# Altium schematic sheet kondratchenko_telemetry_board.SchDoc: =title_line_1 + title_line_2
size 840 x 594 mm; SheetNumber: n
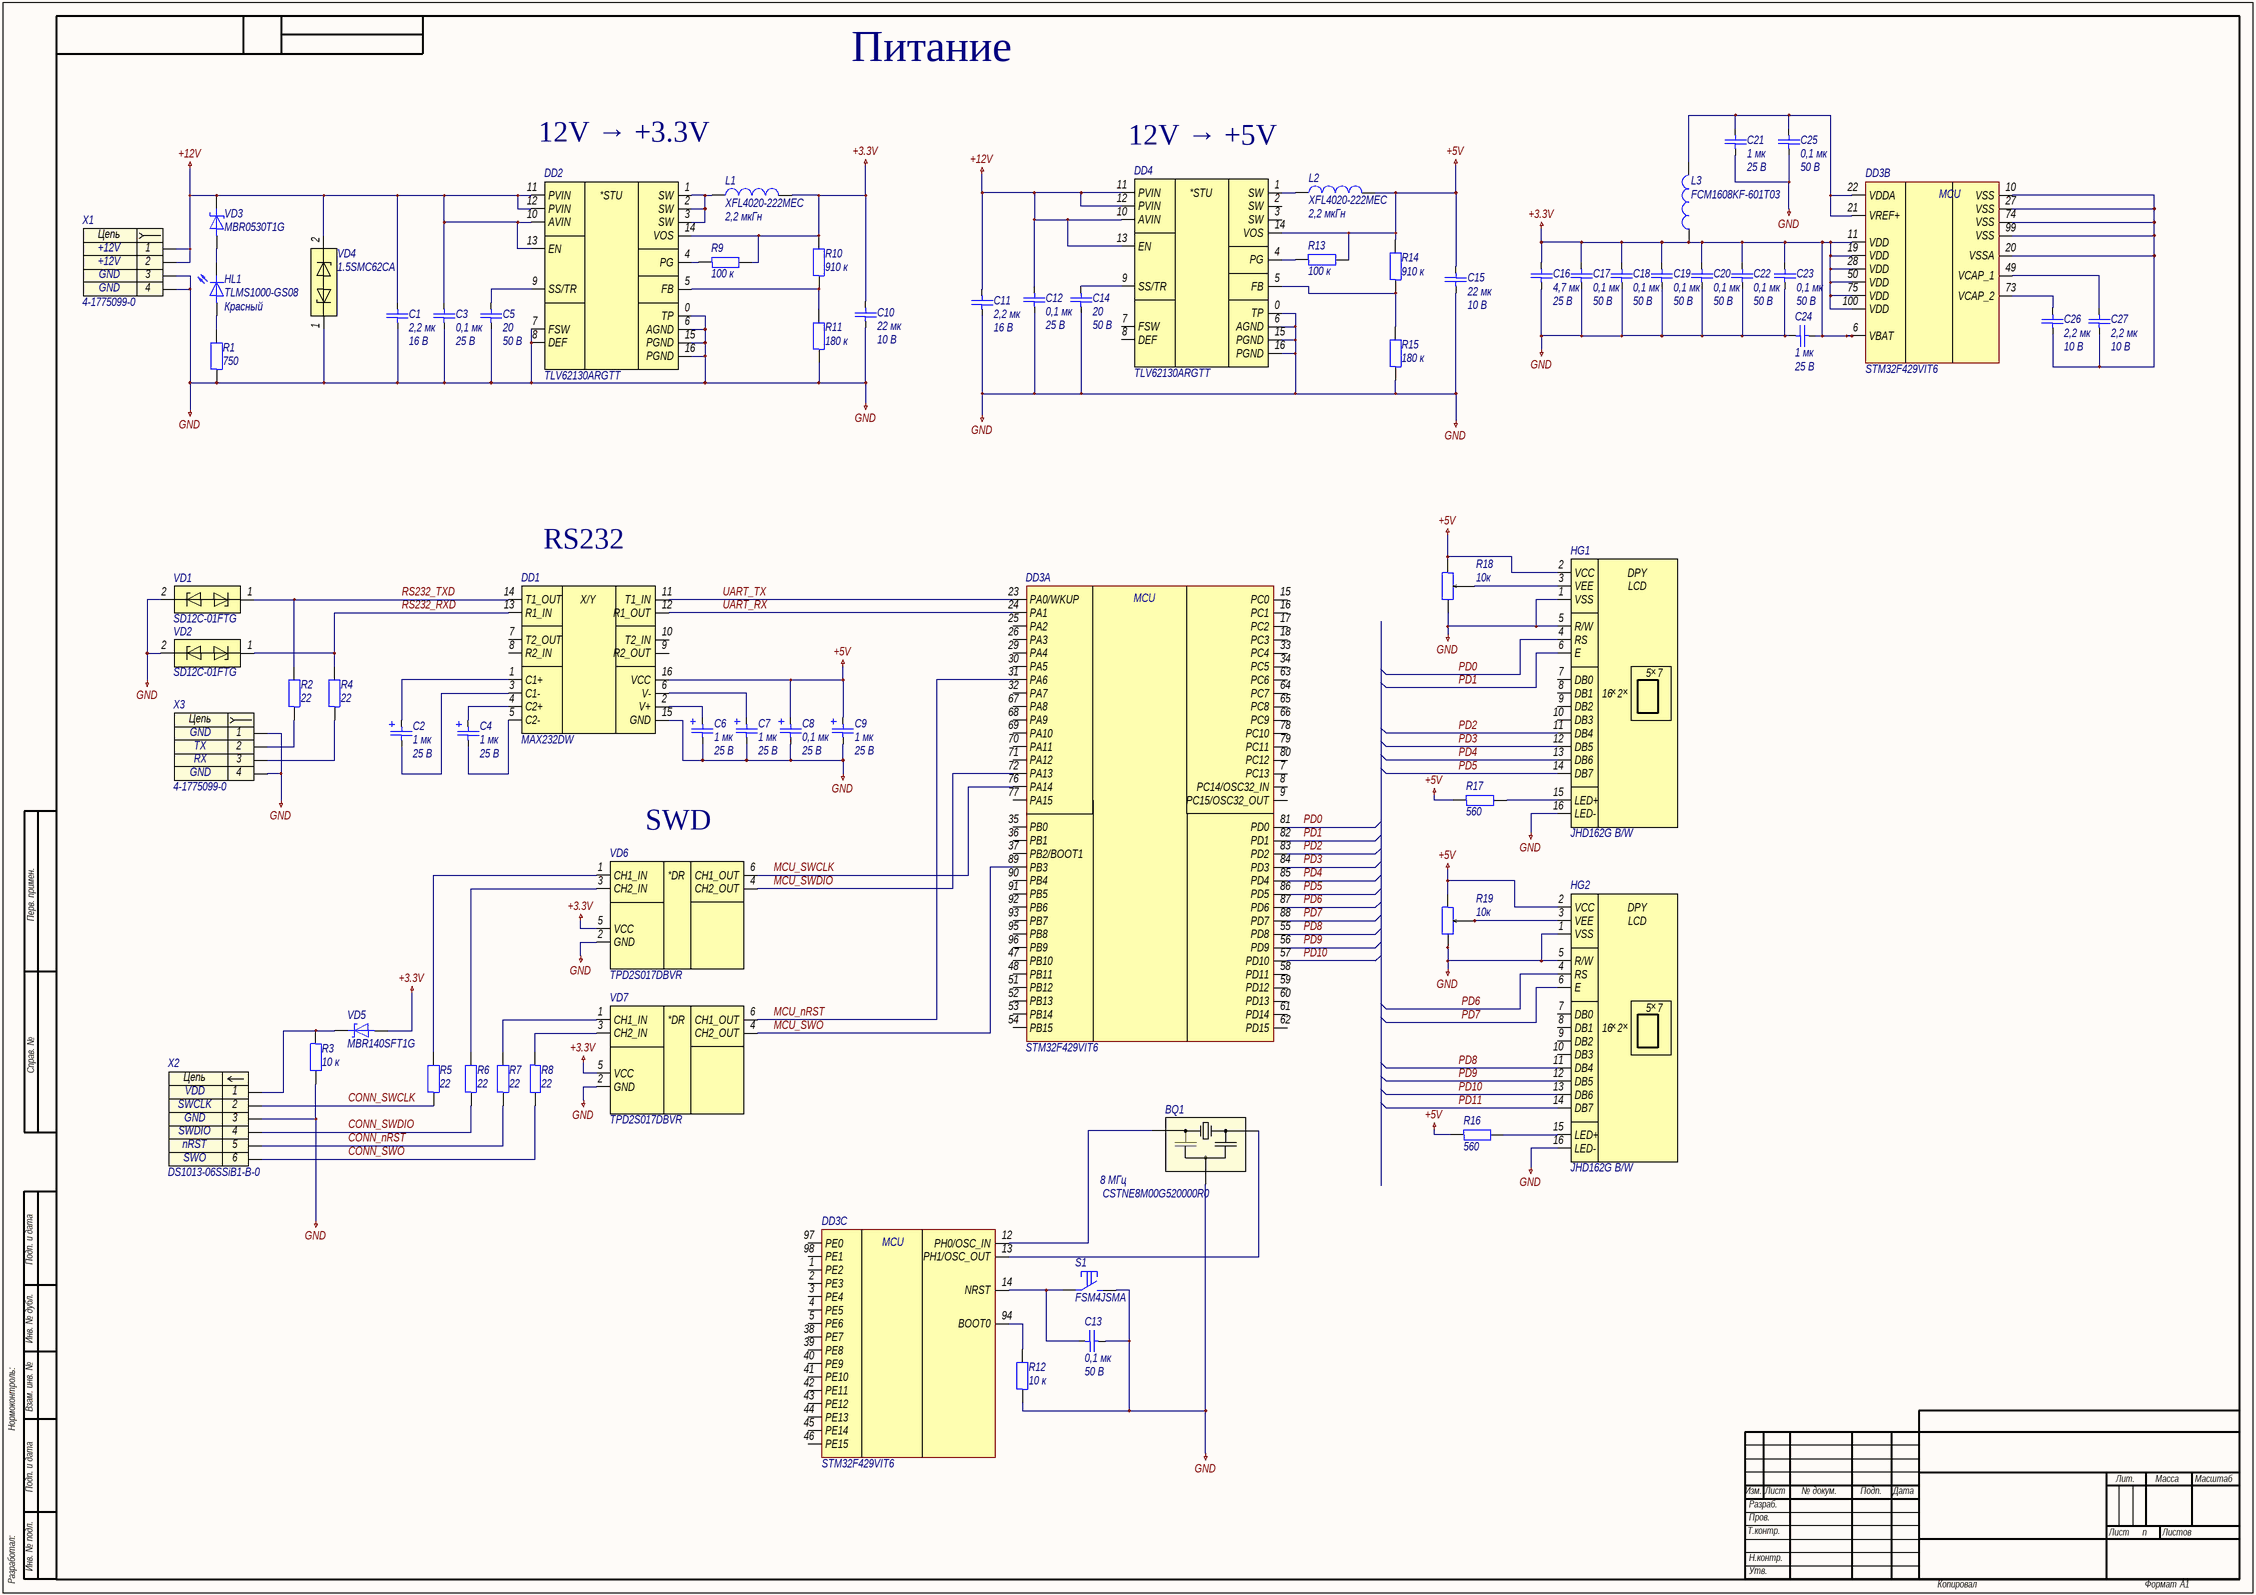
[diagram p0: kondratchenko_telemetry_board.SchDoc]

## Parts
BQ1  CSTNE8M00G520000R0  Частотa: 8 МГц  [CSTCE-3-P120-320X130X70]
C1  2,2 мк  Напряжение: 16 В  [C0603]
C2  1 мк  Напряжение: 25 В  [C3216-18]
C3  0,1 мк  Напряжение: 25 В  [C0603]
C4  1 мк  Напряжение: 25 В  [C3216-18]
C5  20  Напряжение: 50 В  [C0603]
C6  1 мк  Напряжение: 25 В  [C3216-18]
C7  1 мк  Напряжение: 25 В  [C3216-18]
C8  0,1 мк  Напряжение: 25 В  [C3216-18]
C9  1 мк  Напряжение: 25 В  [C3216-18]
C10  22 мк  Напряжение: 10 В  [C1206]
C11  2,2 мк  Напряжение: 16 В  [C0603]
C12  0,1 мк  Напряжение: 25 В  [C0603]
C13  0,1 мк  Напряжение: 50 В  [C0603]
C14  20  Напряжение: 50 В  [C0603]
C15  22 мк  Напряжение: 10 В  [C1206]
C16  4,7 мк  Напряжение: 25 В  [C0603]
C17  0,1 мк  Напряжение: 50 В  [C0603]
C18  0,1 мк  Напряжение: 50 В  [C0603]
C19  0,1 мк  Напряжение: 50 В  [C0603]
C20  0,1 мк  Напряжение: 50 В  [C0603]
C21  1 мк  Напряжение: 25 В  [C0603]
C22  0,1 мк  Напряжение: 50 В  [C0603]
C23  0,1 мк  Напряжение: 50 В  [C0603]
C24  1 мк  Напряжение: 25 В  [C0603]
C25  0,1 мк  Напряжение: 50 В  [C0603]
C26  2,2 мк  Напряжение: 10 В  [C0603]
C27  2,2 мк  Напряжение: 10 В  [C0603]
DD1  MAX232DW  [SOIC-16-P127-1030X750X265-L84X41]
DD2  TLV62130ARGTT  [WQFN-16-P50-300X300X100-L40X24-T168X168]
DD3  STM32F429VIT6  [LQFP-100-P50-1400X1400X160-L60X22]  (parts A,B,C of 3)
DD4  TLV62130ARGTT  [WQFN-16-P50-300X300X100-L40X24-T168X168]
HG1  JHD162G B/W  [JHD162G B/W]
HG2  JHD162G B/W  [JHD162G B/W]
HL1  TLMS1000-GS08  Цвет: Красный  [HL0603]
L1  XFL4020-222MEC  Индуктивность: 2,2 мкГн  [XFL-2-400X400X210]
L2  XFL4020-222MEC  Индуктивность: 2,2 мкГн  [XFL-2-400X400X210]
L3  FCM1608KF-601T03  [FCM-2-0603]
R1  750  [R0603]
R2  22  [R0603]
R3  10 к  [R0603]
R4  22  [R0603]
R5  22  [R0603]
R6  22  [R0603]
R7  22  [R0603]
R8  22  [R0603]
R9  100 к  [R0603]
R10  910 к  [R0603]
R11  180 к  [R0603]
R12  10 к  [R0603]
R13  100 к  [R0603]
R14  910 к  [R0603]
R15  180 к  [R0603]
R16  560  [R0603]
R17  560  [R0603]
R18  10к  [R3362]
R19  10к  [R3362]
S1  FSM4JSMA  [FSM4JSMA]
VD1  SD12C-01FTG  [SOD-323-257X130X114]
VD2  SD12C-01FTG  [SOD-323-257X130X114]
VD3  MBR0530T1G  [SOD-123-368X160X135]
VD4  1.5SMC62CA  [DO-214AB-790X590X262]
VD5  MBR140SFT1G  [SOD-123FL-370X165X98]
VD6  TPD2S017DBVR  [SOT-23-6-P95-290X280X145]
VD7  TPD2S017DBVR  [SOT-23-6-P95-290X280X145]
X1  4-1775099-0  [4-1775099-0]
X2  DS1013-06SSiB1-B-0  [DS1013-06SSiB1-B-0]
X3  4-1775099-0  [4-1775099-0]

## Nets
+3.3V: C10.1 C16.1 C17.1 C18.1 C19.1 C20.1 C22.1 C23.1 C24.1 DD2.14(VOS) DD3.6(VBAT) DD3.11(VDD) DD3.19(VDD) DD3.28(VDD) DD3.50(VDD) DD3.75(VDD) DD3.100(VDD) L1.2 L3.1 R9.2 R10.2 VD5.2 VD6.5(VCC) VD7.5(VCC)
+5V: C8.1 C9.1 C15.2 DD1.16(VCC) DD4.14(VOS) HG1.2(VCC) HG2.2(VCC) L2.2 R13.2 R14.2 R16.1 R17.1 R18.1 R19.1
+12V: C1.1 C3.1 C11.1 C12.1 DD2.10(AVIN) DD2.11(PVIN) DD2.12(PVIN) DD2.13(EN) DD4.10(AVIN) DD4.11(PVIN) DD4.12(PVIN) DD4.13(EN) VD3.1 VD4.2 X1.1 X1.2
GND: BQ1.2 C1.2 C3.2 C5.2 C6.2 C7.2 C8.2 C9.2 C10.2 C11.2 C12.2 C13.1 C14.2 C15.1 C16.2 C17.2 C18.2 C19.2 C20.2 C21.2 C22.2 C23.2 C24.2 C25.2 DD1.15(GND) DD2.0(TP) DD2.6(AGND) DD2.7(FSW) DD2.8(DEF) DD2.15(PGND) DD2.16(PGND) DD4.0(TP) DD4.6(AGND) DD4.15(PGND) DD4.16(PGND) HG1.1(VSS) HG1.5(R/W) HG1.16(LED-) HG2.1(VSS) HG2.5(R/W) HG2.16(LED-) R1.1 R3.2 R11.1 R12.1 R15.1 R18.3 R19.3 S1.2 VD1.2 VD2.2 VD4.1 VD6.2(GND) VD7.2(GND) X1.3 X1.4 X2.3 X3.1 X3.4
CONN_nRST: R7.1 X2.5
CONN_SWCLK: R5.1 X2.2
CONN_SWDIO: R6.1 X2.4
CONN_SWO: R8.2 X2.6
MCU_nRST: DD3.31(PA6) VD7.6(CH1_OUT)
MCU_SWCLK: DD3.76(PA14) VD6.6(CH1_OUT)
MCU_SWDIO: DD3.72(PA13) VD6.4(CH2_OUT)
MCU_SWO: DD3.89(PB3) VD7.4(CH2_OUT)
PD0: DD3.81(PD0) HG1.4(RS)
PD1: DD3.82(PD1) HG1.6(E)
PD2: DD3.83(PD2) HG1.11(DB4)
PD3: DD3.84(PD3) HG1.12(DB5)
PD4: DD3.85(PD4) HG1.13(DB6)
PD5: DD3.86(PD5) HG1.14(DB7)
PD6: DD3.87(PD6) HG2.4(RS)
PD7: DD3.88(PD7) HG2.6(E)
PD8: DD3.55(PD8) HG2.11(DB4)
PD9: DD3.56(PD9) HG2.12(DB5)
PD10: DD3.57(PD10) HG2.13(DB6)
PD11: HG2.14(DB7)
RS232_RXD: DD1.13(R1_IN) R4.2 VD2.1
RS232_TXD: DD1.14(T1_OUT) R2.2 VD1.1
UART_RX: DD1.12(R1_OUT) DD3.24(PA1)
UART_TX: DD1.11(T1_IN) DD3.23(PA0/WKUP)
NetBQ1_1: BQ1.1 DD3.13(PH1/OSC_OUT)
NetBQ1_3: BQ1.3 DD3.12(PH0/OSC_IN)
NetC2_1: C2.1 DD1.1(C1+)
NetC2_2: C2.2 DD1.3(C1-)
NetC4_1: C4.1 DD1.4(C2+)
NetC4_2: C4.2 DD1.5(C2-)
NetC5_1: C5.1 DD2.9(SS/TR)
NetC6_1: C6.1 DD1.2(V+)
NetC7_1: C7.1 DD1.6(V-)
NetC13_2: C13.2 DD3.14(NRST) S1.1
NetC14_1: C14.1 DD4.9(SS/TR)
NetC21_1: C21.1 C25.1 DD3.21(VREF+) DD3.22(VDDA) L3.2
NetC26_1: C26.1 DD3.73(VCAP_2)
NetC26_2: C26.2 C27.2 DD3.10(VSS) DD3.20(VSSA) DD3.27(VSS) DD3.74(VSS) DD3.99(VSS)
NetC27_1: C27.1 DD3.49(VCAP_1)
NetDD2_1: DD2.1(SW) DD2.2(SW) DD2.3(SW) L1.1
NetDD2_4: DD2.4(PG) R9.1
NetDD2_5: DD2.5(FB) R10.1 R11.2
NetDD3_94: DD3.94(BOOT0) R12.2
NetDD4_1: DD4.1(SW) L2.1
NetDD4_4: DD4.4(PG) R13.1
NetDD4_5: DD4.5(FB) R14.1 R15.2
NetHG1_3: HG1.3(VEE) R18.2
NetHG1_15: HG1.15(LED+) R17.2
NetHG2_3: HG2.3(VEE) R19.2
NetHG2_15: HG2.15(LED+) R16.2
NetHL1_1: HL1.1 VD3.2
NetHL1_2: HL1.2 R1.2
NetR2_1: R2.1 X3.2
NetR3_1: R3.1 VD5.1 X2.1
NetR4_1: R4.1 X3.3
NetR5_2: R5.2 VD6.1(CH1_IN)
NetR6_2: R6.2 VD6.3(CH2_IN)
NetR7_2: R7.2 VD7.1(CH1_IN)
NetR8_1: R8.1 VD7.3(CH2_IN)

Not connected (* = marked no-connect by the designer): DD1 7(T2_OUT) 8(R2_IN) 9(R2_OUT) 10(T2_IN); DD3 1(PE2) 2(PE3) 3(PE4) 4(PE5) 5(PE6) 7(PC13) 8(PC14/OSC32_IN) 9(PC15/OSC32_OUT) 15(PC0) 16(PC1) 17(PC2) 18(PC3) 25(PA2) 26(PA3) 29(PA4) 30(PA5) 32(PA7) 33(PC4) 34(PC5) 35(PB0) 36(PB1) 37(PB2/BOOT1) 38(PE7) 39(PE8) 40(PE9) 41(PE10) 42(PE11) 43(PE12) 44(PE13) 45(PE14) 46(PE15) 47(PB10) 48(PB11) 51(PB12) 52(PB13) 53(PB14) 54(PB15) 58(PD11) 59(PD12) 60(PD13) 61(PD14) 62(PD15) 63(PC6) 64(PC7) 65(PC8) 66(PC9) 67(PA8) 68(PA9) 69(PA10) 70(PA11) 71(PA12) 77(PA15) 78(PC10) 79(PC11) 80(PC12) 90(PB4) 91(PB5) 92(PB6) 93(PB7) 95(PB8) 96(PB9) 97(PE0) 98(PE1); DD4 2(SW) 3(SW) 7(FSW) 8(DEF); HG1 7(DB0) 8(DB1) 9(DB2) 10(DB3); HG2 7(DB0) 8(DB1) 9(DB2) 10(DB3)

## Notes on the sheet
- Питание
- 12V → +3.3V
- 12V → +5V
- RS232
- SWD
- Перв. примен.
- Справ. №
- Подп. и дата
- Инв. № дубл.
- Нормоконтроль:
- Взам. инв. №
- Изм.
- Лист
- № докум.
- Подп.
- Дата
- Лит.
- Масса
- Масштаб
- Т.контр.
- Пров.
- Разраб.
- Листов
- Разработал:
- Инв. № подл.
- Н.контр.
- Утв.
- Копировал
- Формат
- А1
- (in symbol dd0004, part A) MCU
- (in symbol dd0004, part B) MCU
- (in symbol dd0004, part C) MCU
- (in symbol dd0014) X/Y
- (in symbol dd0017) *STU
- (in symbol hg0001) DPY; LCD; ×
- (in symbol vd0016) *DR
- (in symbol x0006) Цепь
- (in symbol x0022) Цепь

## Library data of the parts
BQ1 = bq0001: =Описание; ID: bq0001; Фамилия: Игнатова; Описание: Керамический резонатор 8 МГц со встроенными конденсаторами; Производитель: Murata Manufacturing Co., Ltd.; Корпус: 3,20 x 1,30 x 0,70; Наименование: CSTNE8M00G520000R0; Частота: 8 МГц; HelpURL: https://www.murata.com/products/productdetail?partno=CSTNE8M00G520000R0
C1 C11 = c0126: =Описание; ID: c0126; Фамилия: Паньков; Описание: Конденсатор керамический чип 0603 2,2 мкФ 16 В ±10 %; Наименование: CC0603KRX7R7BB225; Производитель: YAGEO Corp.; Отклонение: ±10 %; Рабочие температуры: от –55 °С до +125 °С; Температурный коэффициент емкости: X7R; Корпус: 0603; Номинал: 2,2 мк; Номинальное напряжение: 16 В; HelpURL: https://www.yageo.com/upload/media/product/productsearch/datasheet/mlcc/UPY-GPHC_X7R_6.3V-to-50V_20.pdf
C2 C4 C6 C7 C9 = c0014: =Описание; ID: c0014; Фамилия: Ларионов; Описание: Конденсатор танталовый чип 3216-18 1 мкФ 25 В ±10 %; Наименование: 293D105X9025A2TE3; Производитель: Vishay Intertechnology, Inc.; Отклонение: ±10 %; Эквивалентное последовательное сопротивление: 7,6 Ом; Среднеквадратичный размах пульсации тока: 0,10 А; Рабочие температуры: от –55 °С до +125 °С; Корпус: 3216-18; Номинал: 1 мк; Номинальное напряжение: 25 В; HelpURL: https://www.vishay.com/capacitors/list/product-40002/
C3 C12 = c0085: =Описание; ID: c0085; Фамилия: Паньков; Описание: Конденсатор керамический чип 0603 100 нФ 25 В ±10 %; Наименование: CC0603KRX7R8BB104; Производитель: YAGEO Corp.; Отклонение: ±10 %; Рабочие температуры: от –55 °С до +125 °С; Температурный коэффициент емкости: X7R; Корпус: 0603; Номинал: 0,1 мк; Номинальное напряжение: 25 В; HelpURL: https://www.yageo.com/upload/media/product/productsearch/datasheet/mlcc/UPY-GPHC_X7R_6.3V-to-50V_20.pdf
C5 C14 = c0021: =Описание; ID: c0021; Фамилия: Паньков; Описание: Конденсатор керамический чип 0603 20 пФ 50 В ±1 %; Наименование: CC0603FRNPO9BN200; Производитель: YAGEO Corp.; Отклонение: ±1 %; Рабочие температуры: от –55 °С до +125 °С; Температурный коэффициент емкости: C0G; Корпус: 0603; Номинал: 20; Номинальное напряжение: 50 В; HelpURL: https://www.yageo.com/upload/media/product/productsearch/datasheet/mlcc/UPY-GP_NP0_16V-to-50V_18.pdf
C8 = c0014: =Описание; ID: c0014; Фамилия: Ларионов; Описание: Конденсатор танталовый чип 3216-18 1 мкФ 25 В ±10 %; Наименование: 293D105X9025A2TE3; Производитель: Vishay Intertechnology, Inc.; Номинал: 1 мк; Отклонение: ±10 %; Эквивалентное последовательное сопротивление: 7,6 Ом; Среднеквадратичный размах пульсации тока: 0,10 А; Рабочие температуры: от –55 °С до +125 °С; Корпус: 3216-18; Номинальное напряжение: 25 В; HelpURL: https://www.vishay.com/capacitors/list/product-40002/
C10 C15 = c0159: =Описание; ID: c0159; Фамилия: Паньков; Описание: Конденсатор керамический чип 1206 22 мкФ 10 В ±10 %; Наименование: CC1206KKX5R6BB226; Производитель: YAGEO Corp.; Отклонение: ±10 %; Рабочие температуры: от –55 °С до +85 °С; Температурный коэффициент емкости: X5R; Корпус: 1206; Номинал: 22 мк; Номинальное напряжение: 10 В; HelpURL: https://www.yageo.com/upload/media/product/productsearch/datasheet/mlcc/UPY-GPHC_X5R_4V-to-50V_26.pdf
C13 C17-C20 C22 C23 C25 = c0087: =Описание; ID: c0087; Фамилия: Ларионов; Описание: Конденсатор керамический чип 0603 100 нФ 50 В ±5 %; Наименование: CC0603JRX7R9BB104; Производитель: YAGEO Corp.; Отклонение: ±5 %; Рабочие температуры: от –55 °С до +125 °С; Температурный коэффициент емкости: X7R; Корпус: 0603; Номинал: 0,1 мк; Номинальное напряжение: 50 В; HelpURL: https://www.yageo.com/upload/media/product/productsearch/datasheet/mlcc/UPY-GPHC_X7R_6.3V-to-50V_20.pdf
C16 = c0138: =Описание; ID: c0138; Фамилия: Ларионов; Описание: Конденсатор керамический чип 0603 4,7 мкФ 25 В ±10 %; Наименование: CC0603KRX5R8BB475; Производитель: YAGEO Corp.; Отклонение: ±10 %; Рабочие температуры: от –55 °С до +85 °С; Температурный коэффициент емкости: X5R; Корпус: 0603; Номинал: 4,7 мк; Номинальное напряжение: 25 В; HelpURL: https://www.yageo.com/upload/media/product/productsearch/datasheet/mlcc/UPY-GPHC_X5R_4V-to-50V_26.pdf
C21 C24 = c0117: =Описание; ID: c0117; Фамилия: Ларионов; Описание: Конденсатор керамический чип 0603 1 мкФ 25 В ±10 %; Наименование: CC0603KRX7R8BB105; Производитель: YAGEO Corp.; Отклонение: ±10 %; Рабочие температуры: от –55 °С до +125 °С; Температурный коэффициент емкости: X7R; Корпус: 0603; Номинал: 1 мк; Номинальное напряжение: 25 В; HelpURL: https://www.yageo.com/upload/media/product/productsearch/datasheet/mlcc/UPY-GPHC_X7R_6.3V-to-50V_20.pdf
C26 C27 = c0124: =Описание; ID: c0124; Фамилия: Чернов; Описание: Конденсатор керамический чип 0603 2,2 мкФ 10 В ±10 %; Наименование: CC0603KRX7R6BB225; Производитель: YAGEO Corp.; Отклонение: ±10 %; Рабочие температуры: от –55 °С до +125 °С; Температурный коэффициент емкости: X7R; Корпус: 0603; Номинал: 2,2 мк; Номинальное напряжение: 10 В; HelpURL: https://www.yageo.com/upload/media/product/productsearch/datasheet/mlcc/UPY-GPHC_X7R_6.3V-to-50V_20.pdf
DD1 = dd0014: =Описание; ID: dd0014; Фамилия: Паньков; Описание: Приемопередатчик RS-232; Производитель: Texas Instruments Inc.; Рабочие температуры: от 0 до +70 °C; Корпус: SOIC-16; Наименование: MAX232DW; HelpURL: https://www.ti.com/product/MAX232
DD2 DD4 = dd0017: =Описание; ID: dd0017; Фамилия: Самарин; Описание: Понижающий преобразователь напряжения 3,0…17 В / 0,9…5,25 В и 3,0 А; Производитель: Texas Instruments Inc.; Входное напряжение: от 3,0 В до 17 В; Выходное напряжение: от 0,9 до 5,25 В; Коммутируемый ток: до 3,0 А; Частота переключения: от 1,25 МГц до 2,5 МГц; Рабочие температуры: от –40 °С до +85 °С; Корпус: WQFN-16; Наименование: TLV62130ARGTT; HelpURL: https://www.ti.com/product/TLV62130
DD3 = dd0004: =Описание; ID: dd0004; Фамилия: Кондратченко; Описание: ARM Cortex-M4 32-разрядный микроконтроллер 180 МГц 2 Мбайт FLASH-памяти; Производитель: STMicroelectronics; Рабочее напряжение: от 1,7 В до 3,6 В; Максимальная тактовая частота: 180 МГц; Поддерживаемые интерфейсы: CAN, I2C, SAI, I2S/SPI, UART/USART, USB; Рабочие температуры: от –40 °С до +85 °С; Корпус: LQFP-100; Наименование: STM32F429VIT6; HelpURL: https://www.st.com/en/microcontrollers-microprocessors/stm32f429vi.html
HG1 HG2 = hg0001: =Описание; ID: hg0001; Фамилия: Игнатова; Описание: Жидкокристаллический дисплей 16x2 символов белый/синий; Производитель: Shenzhen Jing Handa Electronics Co. Ltd; Рабочее напряжение: от 4,5 В до 5,5 В; Рабочие температуры: от –20 °С до +70 °С; Наименование: JHD162G B/W; HelpURL: http://www.jhdlcd.com.cn/162character/22-16.html
HL1 = hl0001: =Описание; ID: hl0001; Фамилия: Ларионов; Описание: Светодиод чип 0603 красный; Производитель: Vishay Intertechnology, Inc.; Номинальная сила света: 4 мкд; Номинальная длина волны: 628 нм; Номинальный прямой ток: 15 мА; Номинальное падение напряжения: 1,8 В; Рассеиваемая мощность: 40 мВт; Рабочие температуры: от –40 °С до +100 °С; Корпус: 0603; Наименование: TLMS1000-GS08; HelpURL: https://www.vishay.com/leds/list/product-83172/
L1 L2 = l0002: =Описание; ID: l0002; Фамилия: Ларионов; Описание: Катушка индуктивности 2,2 мкГн ±20 %; Производитель: Coilcraft, Inc.; Отклонение: ±20 %; Номинальное активное сопротивление: 21,35 мОм; Максимальное активное сопротивление: 23,5 мОм; Резонансная частота: 38 МГц; Номинальный ток (при нагреве на 20 °С/40 °С): 6 А; Ток насыщения: 3,5 А; Рабочее напряжение: от 0 В до 20 В; Рабочие температуры: от –40 °С до +125 °С; Корпус: 4,0 x 4,0 x 2,1; Наименование: XFL4020-222MEC; Номинал: 2,2 мкГн; HelpURL: https://www.coilcraft.com/en-us/products/power/shielded-inductors/molded-inductor/xfl/xfl4020/
L3 = l0004: =Описание; ID: l0004; Фамилия: Игнатова; Описание: Ферритовая бусина 600 Ом ±25 %; Производитель: TAI-TECH Advanced Electronics Co., Ltd.; Сопротивление, 100 МГц: 600 Ом; Отклонение, 100 МГц: ±25 %; Сопротивление при постоянном токе: 0,5 Ом; Рабочие температуры: от –55 °С до +125 °С; Корпус: 0603; Наименование: FCM1608KF-601T03; HelpURL: https://www.tai-tech.com.tw/en/product?mcls=&cls=1489980553&cls2=1490267380&cls3=&pid=1491959545
R1 = r0073: =Описание; ID: r0073; Фамилия: Паньков; Описание: Резистор чип 0603 750 Ом ±1 % 0,1 Вт; Наименование: RC0603FR-07750RL; Производитель: YAGEO Corp.; Отклонение: ±1 %; Номинальное напряжение: 75 В; Номинальный ток: 1 А; Рабочие температуры: от –55 °С до +155 °С; Корпус: 0603; Примечание: Ряд E24; Номинал: 750; HelpURL: https://www.yageo.com/upload/media/product/productsearch/datasheet/rchip/PYu-RC_Group_51_RoHS_L_11.pdf
R2 R4-R8 = r0034: =Описание; ID: r0034; Фамилия: Ларионов; Описание: Резистор чип 0603 22 Ом ±1 % 0,1 Вт; Наименование: RC0603FR-0722RL; Производитель: YAGEO Corp.; Отклонение: ±1 %; Номинальное напряжение: 75 В; Номинальный ток: 1 А; Рабочие температуры: от –55 °С до +155 °С; Корпус: 0603; Примечание: Ряд E24; Номинал: 22; HelpURL: https://www.yageo.com/upload/media/product/productsearch/datasheet/rchip/PYu-RC_Group_51_RoHS_L_11.pdf
R3 R12 = r0105: =Описание; ID: r0105; Фамилия: Самарин; Описание: Резистор чип 0603 10 кОм ±1 % 0,1 Вт; Наименование: RC0603FR-0710KL; Производитель: YAGEO Corp.; Отклонение: ±1 %; Номинальное напряжение: 75 В; Номинальный ток: 1 А; Рабочие температуры: от –55 °С до +155 °С; Корпус: 0603; Примечание: Ряд E24; Номинал: 10 к; HelpURL: https://www.yageo.com/upload/media/product/productsearch/datasheet/rchip/PYu-RC_Group_51_RoHS_L_11.pdf
R9 R13 = r0141: =Описание; ID: r0141; Фамилия: Водорезов; Описание: Резистор чип 0603 100 кОм ±1 % 0,1 Вт; Наименование: RC0603FR-07100KL; Производитель: YAGEO Corp.; Отклонение: ±1 %; Номинальное напряжение: 75 В; Номинальный ток: 1 А; Рабочие температуры: от –55 °С до +155 °С; Корпус: 0603; Примечание: Ряд E24; Номинал: 100 к; HelpURL: https://www.yageo.com/upload/media/product/productsearch/datasheet/rchip/PYu-RC_Group_51_RoHS_L_11.pdf
R10 R14 = r0172: =Описание; ID: r0172; Фамилия: Паньков; Описание: Резистор чип 0603 910 кОм ±1 % 0,1 Вт; Наименование: RC0603FR-07910KL; Производитель: YAGEO Corp.; Отклонение: ±1 %; Номинальное напряжение: 75 В; Номинальный ток: 1 А; Рабочие температуры: от –55 °С до +155 °С; Корпус: 0603; Примечание: Ряд E24; Номинал: 910 к; HelpURL: https://www.yageo.com/upload/media/product/productsearch/datasheet/rchip/PYu-RC_Group_51_RoHS_L_11.pdf
R11 R15 = r0152: =Описание; ID: r0152; Фамилия: Паньков; Описание: Резистор чип 0603 180 кОм ±1 % 0,1 Вт; Наименование: RC0603FR-07180KL; Производитель: YAGEO Corp.; Отклонение: ±1 %; Номинальное напряжение: 75 В; Номинальный ток: 1 А; Рабочие температуры: от –55 °С до +155 °С; Корпус: 0603; Примечание: Ряд E24; Номинал: 180 к; HelpURL: https://www.yageo.com/upload/media/product/productsearch/datasheet/rchip/PYu-RC_Group_51_RoHS_L_11.pdf
R16 R17 = r0070: =Описание; ID: r0070; Фамилия: Паньков; Описание: Резистор чип 0603 560 Ом ±1 % 0,1 Вт; Наименование: RC0603FR-07560RL; Производитель: YAGEO Corp.; Отклонение: ±1 %; Номинальное напряжение: 75 В; Номинальный ток: 1 А; Рабочие температуры: от –55 °С до +155 °С; Корпус: 0603; Примечание: Ряд E24; Номинал: 560; HelpURL: https://www.yageo.com/upload/media/product/productsearch/datasheet/rchip/PYu-RC_Group_51_RoHS_L_11.pdf
R18 R19 = r0205: =Описание; ID: r0205; Фамилия: Кондратченко; Описание: Подстроечный потенциометр 10кОм ±1 % 0,5 Вт; Наименование: 3362P-1-103LF; Производитель: Bourns; Отклонение: ±1 %; Номинальное напряжение: не указано; Рабочие температуры: от –55 °С до +155 °С; Корпус: 3362; Номинал: 10к; Номинальный ток: не указано
S1 = s0001: =Описание; ID: s0001; Фамилия: Паньков; Описание: Тактовая кнопка поверхностного монтажа; Производитель: TE Connectivity; Ток нагрузки: 50 мА @ 24 В; Сопротивление контакта: 100 мОм; Количество контактов: 4; Рабочие температуры: от –35 °С до +85 °С; Промывка: Запрещена; Корпус: 6,00 x 6,00 x 4,98; Наименование: FSM4JSMA; HelpURL: https://www.te.com/usa-en/product-4-1437565-1.html
VD1 VD2 = vd0004: =Описание; ID: vd0004; Фамилия: Ларионов; Описание: Двунаправленная диодная сборка для подавления помех 12 В; Производитель: Littelfuse, Inc.; Корпус: SOD-323; Наименование: SD12C-01FTG; HelpURL: https://www.littelfuse.com/products/tvs-diode-arrays/general-purpose-esd-protection/sdc/sd12c_01ftg.aspx
VD3 = vd0001: =Описание; ID: vd0001; Фамилия: Шкабара; Описание: Диод Шоттки 30 В 0,5 А; Производитель: ON Semiconductor; Максимальное прямое напряжение: 0,43 В; Максимальное обратное напряжение: 30 В; Максимальный прямой ток: 0,5 А; Рабочие температуры: от –65 °С до +125 °С; Корпус: SOD-123; Наименование: MBR0530T1G; HelpURL: https://www.onsemi.com/products/discretes-drivers/diodes-rectifiers/schottky-diodes-schottky-rectifiers/mbr0530t1g
VD4 = vd0009: =Описание; ID: vd0009; Фамилия: Ларионов; Описание: Двунаправленная диодная сборка для подавления помех 53 В; Производитель: Littelfuse, Inc.; Корпус: DO-214AB; Наименование: 1.5SMC62CA; HelpURL: https://www.littelfuse.com/products/tvs-diodes/surface-mount/1_5smc.aspx
VD5 = vd0002: =Описание; ID: vd0002; Фамилия: Паньков; Описание: Диод Шоттки 40 В 1 А; Производитель: ON Semiconductor; Максимальное прямое напряжение: 0,88 В; Максимальное обратное напряжение: 40 В; Максимальный прямой ток: 1 А; Рабочие температуры: от –55 °С до +125 °С; Корпус: SOD-123FL; Наименование: MBR140SFT1G; HelpURL: https://www.onsemi.com/products/discretes-drivers/diodes-rectifiers/schottky-diodes-schottky-rectifiers/mbr140sf
VD6 VD7 = vd0016: =Описание; ID: vd0016; Фамилия: Паньков; Описание: Диодная сборка для подавления помех 5 В; Производитель: Texas Instruments Inc.; Корпус: SOT-23-6; Наименование: TPD2S017DBVR; HelpURL: https://www.ti.com/product/TPD2S017
X1 = x0006: =Описание; Contact_1: +12V; Contact_3: GND; ID: x0006; Фамилия: Ларионов; Описание: ATX Power 4 pin гнездо прямой; Производитель: TE Connectivity; Contact_2: +12V; Contact_4: GND; Наименование: 4-1775099-0; HelpURL: https://www.te.com/usa-en/product-4-1775099-0.html
X2 = x0022: =Описание; Contact_1: VDD; Contact_2: SWCLK; Contact_3: GND; Contact_4: SWDIO; Contact_5: nRST; Contact_6: SWO; ID: x0022; Фамилия: Паньков; Описание: Box Header 6 pin 2,54 мм вилка прямой; Производитель: Connfly Electronic Co., Ltd.; Наименование: DS1013-06SSiB1-B-0; HelpURL: http://en.connfly.group/product/xVkr=EusQssAN0gN=Aos=mU+UrVkR9kqEAN0gN9g+Upc+NB+A
X3 = x0006: =Описание; Contact_1: GND; Contact_2: TX; Contact_3: RX; ID: x0006; Фамилия: Ларионов; Описание: ATX Power 4 pin гнездо прямой; Производитель: TE Connectivity; Contact_4: GND; Наименование: 4-1775099-0; HelpURL: https://www.te.com/usa-en/product-4-1775099-0.html